# Altium project SumoBot.PrjPcb
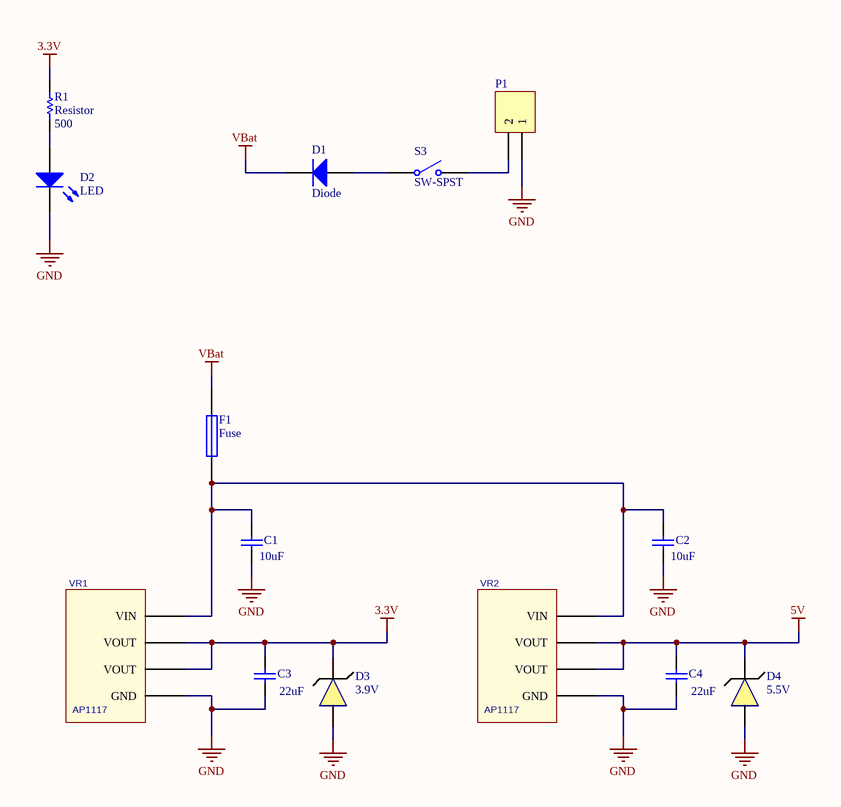
[diagram p0: Power_Regulation.SchDoc]
7 sheets, 86 parts. Net scope: global (net labels, ports and power ports of the same name join across sheets).
Board file: sumobot.PcbDoc
Sheets:
  Power_Regulation.SchDoc
  microcontroller.SchDoc
  Proximity_Sensors.SchDoc
  Motor_Control.SchDoc
  Servo.SchDoc
  Accelerometer.SchDoc
  Reflective_Sensors.SchDoc

## Sheet Power_Regulation.SchDoc
size A

### Parts
C1  value 10uF  [0805]  (hidden comment: Cap)
C2  value 10uF  [0805]  (hidden comment: Cap)
C3  value 22uF  [0805]  (hidden comment: Cap)
C4  value 22uF  [0805]  (hidden comment: Cap)
D1  Diode  [SMA]
D2  LED  [0603]
D3  3.9V  [DO-214AC]
D4  5.5V  [DO-214AC]
F1  Fuse  [0805]
P1  Header 2  [HDR1X2]  (value not drawn)
R1  Resistor  value 500  [0805]
S3  SW-SPST  [SPST Switch]
VR1  AP1117  [SOT-223]
VR2  AP1117  [SOT-223]

### Nets
3.3V: C3.2 D3.1 R1.2 VR1.2(VOUT) VR1.4(VOUT)
5V: C4.2 D4.1 VR2.2(VOUT) VR2.4(VOUT)
GND: C1.1 C2.1 C3.1 C4.1 D2.2(K) D3.2 D4.2 P1.1 VR1.1(GND) VR2.1(GND)
VBat: D1.2(K) F1.2
NetC1_2: C1.2 C2.2 F1.1 VR1.3(VIN) VR2.3(VIN)
NetD1_1: D1.1(A) S3.1(COMMON)
NetD2_1: D2.1(A) R1.1
NetP1_2: P1.2 S3.2(NO)

### Library data of the parts
C1-C4 = Cap: Capacitor
D1 = Diode: Default Diode
D2 = LED: Vendor Part Number: 751-1203-ND; Manufacturer: Vishay; Manufacturer Part Number: TSAL6100; Vendor: Digikey; Published: 16-Mar-2013; LatestRevisionDate: 16-Mar-2013; LatestRevisionNote: Created; PackageReference: LED; Publisher: Anthony Merlino; PackageDescription: 5mm LED; 2 Leads
D3 D4 = Zener Diode
P1 = Header 2: Header, 2-Pin; LatestRevisionDate: 17-Jul-2002; LatestRevisionNote: Re-released for DXP Platform.; Publisher: Altium Limited
S3 = SW-SPST: Single-Pole, Single-Throw Switch; Published: 24-Mar-1999; LatestRevisionDate: 17-Jul-2002; LatestRevisionNote: Re-released for DXP Platform.; PackageReference: SPST-2; Publisher: Altium Limited; PackageDescription: Switch; 2 Leads
F1 = Fuse: Published: 8-Jun-2000; LatestRevisionDate: 17-Jul-2002; LatestRevisionNote: Re-released for DXP Platform.; PackageReference: PIN-W2/E2.8; Publisher: Altium Limited; PackageDescription: Thru-Hole; 2 Leads
R1 = Resistor: Published: 8-Jun-2000; LatestRevisionDate: 17-Jul-2002; LatestRevisionNote: Re-released for DXP Platform.; PackageReference: AXIAL-0.3; Publisher: Altium Limited
VR1 VR2 = AP1117: Value: *

## Sheet microcontroller.SchDoc
size A
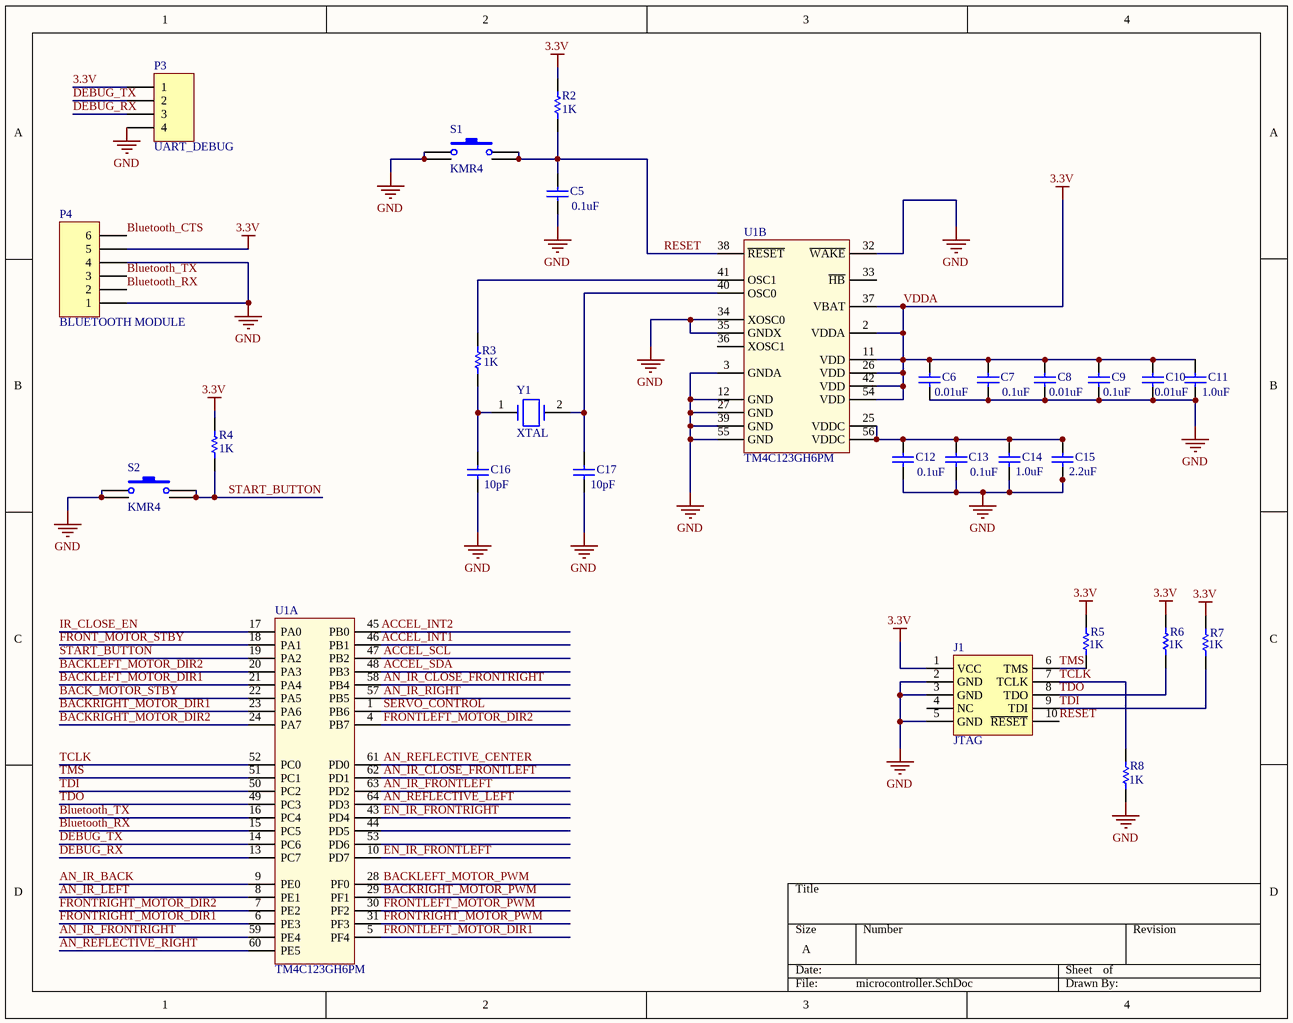
[diagram p1: microcontroller.SchDoc]

### Parts
C5  value 0.1uF  [0805]  (hidden comment: Cap)
C6  value 0.01uF  [0805]  (hidden comment: Cap)
C7  value 0.1uF  [0805]  (hidden comment: Cap)
C8  value 0.01uF  [0805]  (hidden comment: Cap)
C9  value 0.1uF  [0805]  (hidden comment: Cap)
C10  value 0.01uF  [0805]  (hidden comment: Cap)
C11  value 1.0uF  [0805]  (hidden comment: Cap)
C12  value 0.1uF  [0805]  (hidden comment: Cap)
C13  value 0.1uF  [0805]  (hidden comment: Cap)
C14  value 1.0uF  [0805]  (hidden comment: Cap)
C15  value 2.2uF  [0805]  (hidden comment: Cap)
C16  value 10pF  [0805]  (hidden comment: Cap)
C17  value 10pF  [0805]  (hidden comment: Cap)
J1  JTAG  [TAG Connect 10p]
P3  UART_DEBUG  [HDR1X4]
P4  BLUETOOTH MODULE  [HDR1X6]
R2  value 1K  [0805]  (hidden comment: Resistor)
R3  value 1K  [0805]  (hidden comment: Resistor)
R4  value 1K  [0805]  (hidden comment: Resistor)
R5  value 1K  [0805]  (hidden comment: Resistor)
R6  value 1K  [0805]  (hidden comment: Resistor)
R7  value 1K  [0805]  (hidden comment: Resistor)
R8  value 1K  [0805]  (hidden comment: Resistor)
S1  KMR4  [KMR4]
S2  KMR4  [KMR4]
U1  TM4C123GH6PM  [TSQFP50P1200X1200X145-64N]  (parts A,B of 2)
Y1  XTAL  [ABM3_SERIES]

### Nets
3.3V: C6.2 C7.2 C8.2 C9.2 C10.2 C11.2 J1.1(VCC) P3.1 P4.5 R2.2 R4.2 R5.2 R6.2 R7.2 U1.2(VDDA) U1.11(VDD) U1.26(VDD) U1.37(VBAT) U1.42(VDD) U1.54(VDD)  [also labelled VDDA]
GND: C5.1 C6.1 C7.1 C8.1 C9.1 C10.1 C11.1 C12.1 C13.1 C14.1 C15.1 C16.1 C17.1 J1.2(GND) J1.3(GND) J1.5(GND) P3.4 P4.1 P4.4 R8.1 S1.1 S1.3 S2.1 S2.3 U1.3(GNDA) U1.12(GND) U1.27(GND) U1.32(~{WAKE}) U1.34(XOSC0) U1.35(GNDX) U1.39(GND) U1.55(GND)
ACCEL_INT1: U1.46(PB1)
ACCEL_INT2: U1.45(PB0)
ACCEL_SCL: U1.47(PB2)
ACCEL_SDA: U1.48(PB3)
AN_IR_BACK: U1.9(PE0)
AN_IR_CLOSE_FRONTLEFT: U1.62(PD1)
AN_IR_CLOSE_FRONTRIGHT: U1.58(PB4)
AN_IR_FRONTLEFT: U1.63(PD2)
AN_IR_FRONTRIGHT: U1.59(PE4)
AN_IR_LEFT: U1.8(PE1)
AN_IR_RIGHT: U1.57(PB5)
AN_REFLECTIVE_CENTER: U1.61(PD0)
AN_REFLECTIVE_LEFT: U1.64(PD3)
AN_REFLECTIVE_RIGHT: U1.60(PE5)
BACK_MOTOR_STBY: U1.22(PA5)
BACKLEFT_MOTOR_DIR1: U1.21(PA4)
BACKLEFT_MOTOR_DIR2: U1.20(PA3)
BACKLEFT_MOTOR_PWM: U1.28(PF0)
BACKRIGHT_MOTOR_DIR1: U1.23(PA6)
BACKRIGHT_MOTOR_DIR2: U1.24(PA7)
BACKRIGHT_MOTOR_PWM: U1.29(PF1)
Bluetooth_CTS: P4.6
Bluetooth_RX: P4.2 U1.15(PC5)
Bluetooth_TX: P4.3 U1.16(PC4)
DEBUG_RX: P3.3 U1.13(PC7)
DEBUG_TX: P3.2 U1.14(PC6)
EN_IR_FRONTLEFT: U1.10(PD7)
EN_IR_FRONTRIGHT: U1.43(PD4)
FRONT_MOTOR_STBY: U1.18(PA1)
FRONTLEFT_MOTOR_DIR1: U1.5(PF4)
FRONTLEFT_MOTOR_DIR2: U1.4(PB7)
FRONTLEFT_MOTOR_PWM: U1.30(PF2)
FRONTRIGHT_MOTOR_DIR1: U1.6(PE3)
FRONTRIGHT_MOTOR_DIR2: U1.7(PE2)
FRONTRIGHT_MOTOR_PWM: U1.31(PF3)
IR_CLOSE_EN: U1.17(PA0)
RESET: C5.2 J1.10(~{RESET}) R2.1 S1.2 S1.4 U1.38(~{RESET})
SERVO_CONTROL: U1.1(PB6)
START_BUTTON: R4.1 S2.2 S2.4 U1.19(PA2)
TCLK: J1.7(TCLK) R8.2 U1.52(PC0)
TDI: J1.9(TDI) R7.1 U1.50(PC2)
TDO: J1.8(TDO) R6.1 U1.49(PC3)
TMS: J1.6(TMS) R5.1 U1.51(PC1)
NetC12_2: C12.2 C13.2 C14.2 C15.2 U1.25(VDDC) U1.56(VDDC)
NetC16_2: C16.2 R3.1 Y1.1(OSC1)
NetC17_2: C17.2 U1.40(OSC0) Y1.2(OSC2)
NetR3_2: R3.2 U1.41(OSC1)

Not connected (* = marked no-connect by the designer): J1 4(NC); U1 33(~{HB}) 36(XOSC1) 44(PD5) 53(PD6)

### Library data of the parts
C5-C17 = Cap: Capacitor
J1 = 10-Pin JTAG ARM: 10-Pin JTAG Connector for Cortex M4 etc.
P3 = Header 4: Header, 4-Pin; LatestRevisionDate: 17-Jul-2002; LatestRevisionNote: Re-released for DXP Platform.; Publisher: Altium Limited
P4 = Header 6: Header, 6-Pin; LatestRevisionDate: 17-Jul-2002; LatestRevisionNote: Re-released for DXP Platform.; Publisher: Altium Limited
S1 S2 = SPST Tactile Switch: Switch; Published: 24-Mar-1999; LatestRevisionDate: 17-Jul-2002; LatestRevisionNote: Re-released for DXP Platform.; PackageReference: SPST-2; Publisher: Altium Limited
U1 = TM4C123GH6PM: Tiva C TM4C123GH6PM
Y1 = XTAL: Crystal Oscillator; Published: 8-Jun-2000; LatestRevisionDate: 17-Jul-2002; LatestRevisionNote: Re-released for DXP Platform.; PackageReference: R38; Publisher: Altium Limited; PackageDescription: Crystal, Thru-Hole; 2 Leads; Body 3.1 x 8.2 mm (Dia.xH)
R2-R8 = Resistor: Published: 8-Jun-2000; LatestRevisionDate: 17-Jul-2002; LatestRevisionNote: Re-released for DXP Platform.; PackageReference: AXIAL-0.3; Publisher: Altium Limited

## Sheet Proximity_Sensors.SchDoc
size A
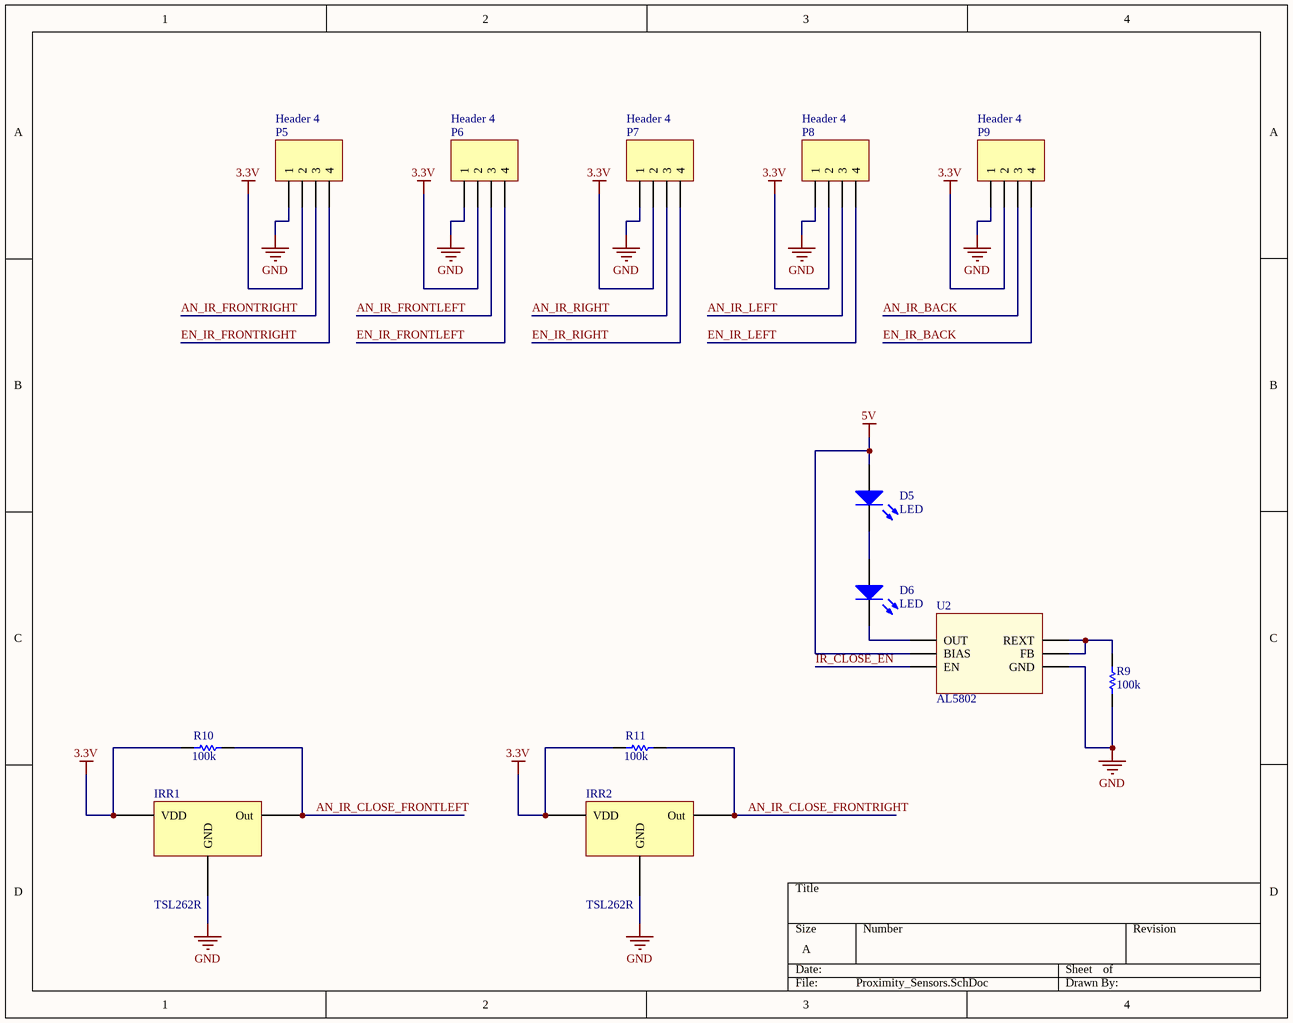
[diagram p2: Proximity_Sensors.SchDoc]

### Parts
D5  LED  [LED-Bent]
D6  LED  [LED-Bent]
IRR1  TSL262R  [TSL262R]
IRR2  TSL262R  [TSL262R]
P5  Header 4  [HDR1X4]
P6  Header 4  [HDR1X4]
P7  Header 4  [HDR1X4]
P8  Header 4  [HDR1X4]
P9  Header 4  [HDR1X4]
R9  value 100k  [0805]  (hidden comment: Resistor)
R10  value 100k  [0805]  (hidden comment: Resistor)
R11  value 100k  [0805]  (hidden comment: Resistor)
U2  AL5802  [SOT26]

### Nets
3.3V: IRR1.1(VDD) IRR2.1(VDD) P5.2 P6.2 P7.2 P8.2 P9.2 R10.1 R11.1
5V: D5.1(A) U2.2(BIAS)
GND: IRR1.0(GND) IRR2.0(GND) P5.1 P6.1 P7.1 P8.1 P9.1 R9.1 U2.4(GND)
AN_IR_BACK: P9.3
AN_IR_CLOSE_FRONTLEFT: IRR1.2(Out) R10.2
AN_IR_CLOSE_FRONTRIGHT: IRR2.2(Out) R11.2
AN_IR_FRONTLEFT: P6.3
AN_IR_FRONTRIGHT: P5.3
AN_IR_LEFT: P8.3
AN_IR_RIGHT: P7.3
EN_IR_BACK: P9.4
EN_IR_FRONTLEFT: P6.4
EN_IR_FRONTRIGHT: P5.4
EN_IR_LEFT: P8.4
EN_IR_RIGHT: P7.4
IR_CLOSE_EN: U2.3(EN)
NetD5_2: D5.2(K) D6.1(A)
NetD6_2: D6.2(K) U2.1(OUT)
NetR9_2: R9.2 U2.5(FB) U2.6(REXT)

### Library data of the parts
D5 D6 = LED: as D2 on sheet Power_Regulation; Published: 16-Mar-2013; LatestRevisionDate: 16-Mar-2013; LatestRevisionNote: Created; PackageReference: LED; Publisher: Anthony Merlino; PackageDescription: 5mm LED; 2 Leads
P5-P9 = Header 4: Header, 4-Pin; LatestRevisionDate: 17-Jul-2002; LatestRevisionNote: Re-released for DXP Platform.; Publisher: Altium Limited
R9-R11 = Resistor: Published: 8-Jun-2000; LatestRevisionDate: 17-Jul-2002; LatestRevisionNote: Re-released for DXP Platform.; PackageReference: AXIAL-0.3; Publisher: Altium Limited

## Sheet Motor_Control.SchDoc
size A
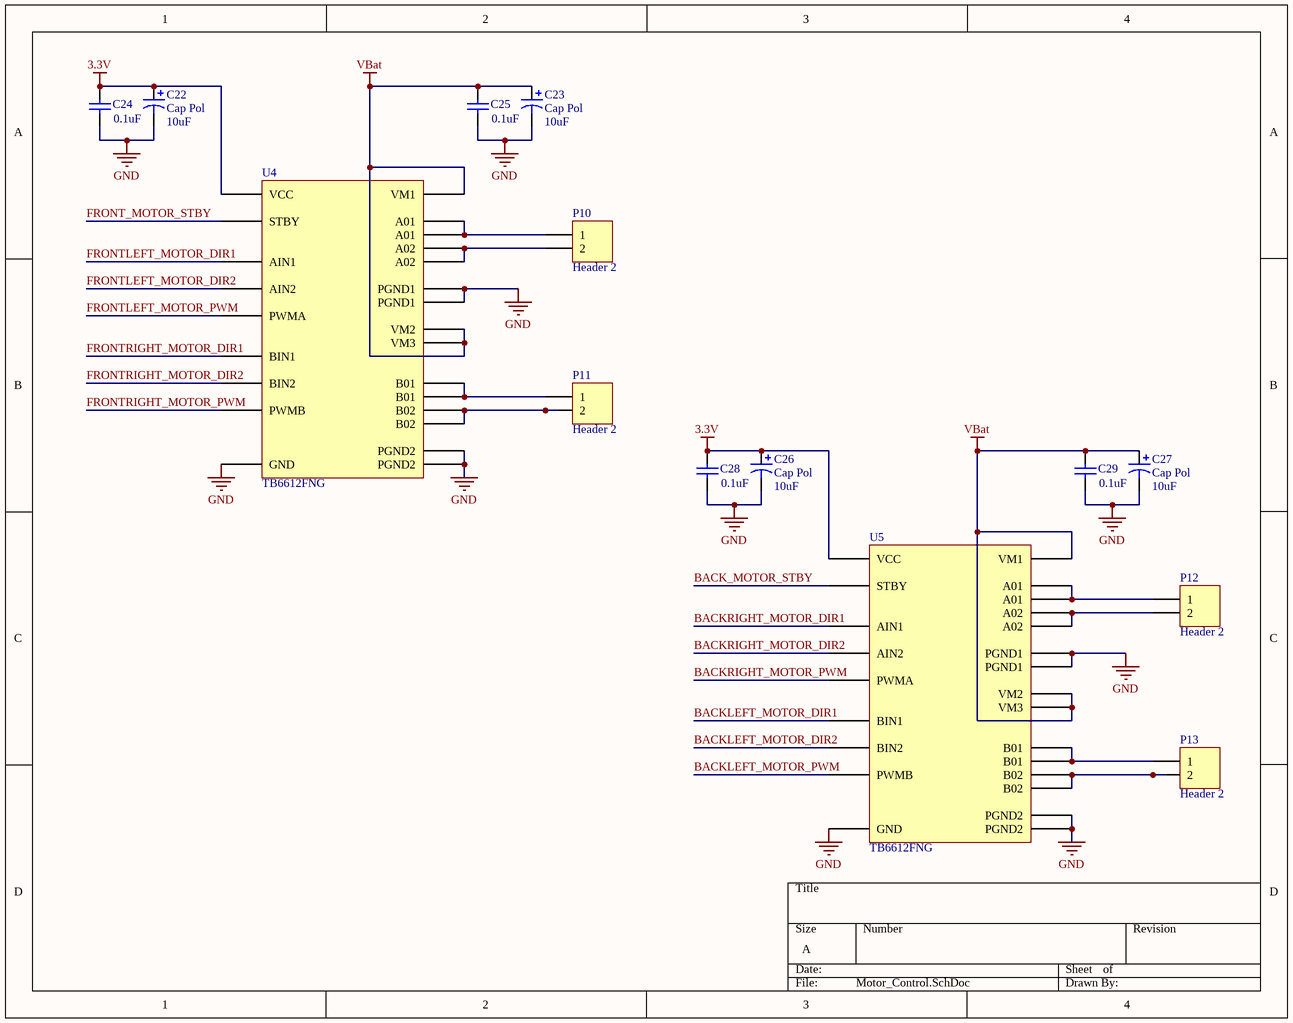
[diagram p3: Motor_Control.SchDoc]

### Parts
C22  Cap Pol  value 10uF  [1206]
C23  Cap Pol  value 10uF  [1206]
C24  value 0.1uF  [0805]  (hidden comment: Cap)
C25  value 0.1uF  [0805]  (hidden comment: Cap)
C26  Cap Pol  value 10uF  [1206]
C27  Cap Pol  value 10uF  [1206]
C28  value 0.1uF  [0805]  (hidden comment: Cap)
C29  value 0.1uF  [0805]  (hidden comment: Cap)
P10  Header 2  [HDR1X2]
P11  Header 2  [HDR1X2]
P12  Header 2  [HDR1X2]
P13  Header 2  [HDR1X2]
U4  TB6612FNG  [SSOP24-P-300-0.65A]
U5  TB6612FNG  [SSOP24-P-300-0.65A]

### Nets
3.3V: C22.1 C24.2 C26.1 C28.2 U4.20(VCC) U5.20(VCC)
GND: C22.2 C23.2 C24.1 C25.1 C26.2 C27.2 C28.1 C29.1 U4.3(PGND1) U4.4(PGND1) U4.9(PGND2) U4.10(PGND2) U4.18(GND) U5.3(PGND1) U5.4(PGND1) U5.9(PGND2) U5.10(PGND2) U5.18(GND)
VBat: C23.1 C25.2 C27.1 C29.2 U4.13(VM2) U4.14(VM3) U4.24(VM1) U5.13(VM2) U5.14(VM3) U5.24(VM1)
BACK_MOTOR_STBY: U5.19(STBY)
BACKLEFT_MOTOR_DIR1: U5.17(BIN1)
BACKLEFT_MOTOR_DIR2: U5.16(BIN2)
BACKLEFT_MOTOR_PWM: U5.15(PWMB)
BACKRIGHT_MOTOR_DIR1: U5.21(AIN1)
BACKRIGHT_MOTOR_DIR2: U5.22(AIN2)
BACKRIGHT_MOTOR_PWM: U5.23(PWMA)
FRONT_MOTOR_STBY: U4.19(STBY)
FRONTLEFT_MOTOR_DIR1: U4.21(AIN1)
FRONTLEFT_MOTOR_DIR2: U4.22(AIN2)
FRONTLEFT_MOTOR_PWM: U4.23(PWMA)
FRONTRIGHT_MOTOR_DIR1: U4.17(BIN1)
FRONTRIGHT_MOTOR_DIR2: U4.16(BIN2)
FRONTRIGHT_MOTOR_PWM: U4.15(PWMB)
NetP10_1: P10.1 U4.1(A01) U4.2(A01)
NetP10_2: P10.2 U4.5(A02) U4.6(A02)
NetP11_1: P11.1 U4.11(B01) U4.12(B01)
NetP11_2: P11.2 U4.7(B02) U4.8(B02)
NetP12_1: P12.1 U5.1(A01) U5.2(A01)
NetP12_2: P12.2 U5.5(A02) U5.6(A02)
NetP13_1: P13.1 U5.11(B01) U5.12(B01)
NetP13_2: P13.2 U5.7(B02) U5.8(B02)

### Library data of the parts
C22 C23 C26 C27 = Cap Pol: Polarized Capacitor
C24 C25 C28 C29 = Cap: Capacitor
P10-P13 = Header 2: Header, 2-Pin; LatestRevisionDate: 17-Jul-2002; LatestRevisionNote: Re-released for DXP Platform.; Publisher: Altium Limited
U4 U5 = TB6612FNG: Vendor Part No.: TB6612FNG(OC8EL)CT-ND; Manufacturer: Toshiba; Vendor: Digikey; Manufacturer Part No: TB6612FNG

## Sheet Servo.SchDoc
size A
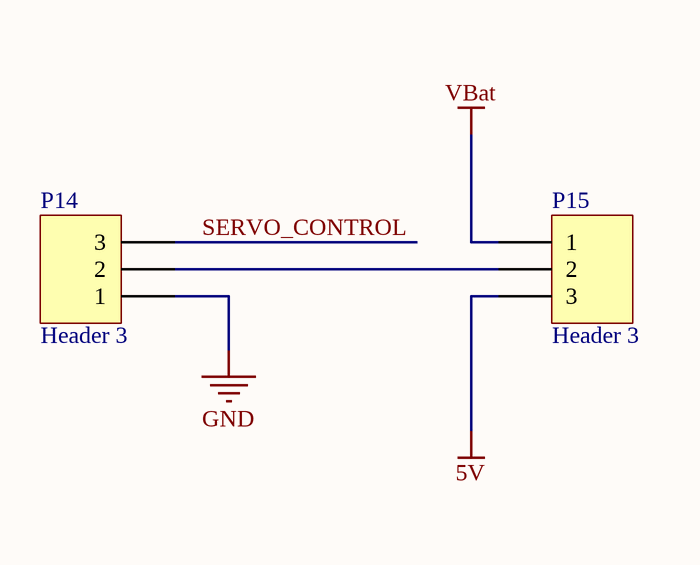
[diagram p4: Servo.SchDoc]

### Parts
P14  Header 3  [HDR1X3]
P15  Header 3  [HDR1X3]

### Nets
5V: P15.3
GND: P14.1
VBat: P15.1
SERVO_CONTROL: P14.3
NetP14_2: P14.2 P15.2

### Library data of the parts
P14 P15 = Header 3: Header, 3-Pin; LatestRevisionDate: 17-Jul-2002; LatestRevisionNote: Re-released for DXP Platform.; Publisher: Altium Limited

## Sheet Accelerometer.SchDoc
size A
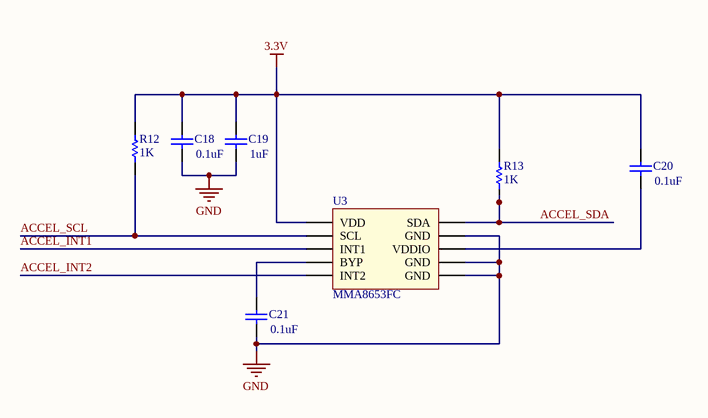
[diagram p5: Accelerometer.SchDoc]

### Parts
C18  value 0.1uF  [0805]  (hidden comment: Cap)
C19  value 1uF  [0805]  (hidden comment: Cap)
C20  value 0.1uF  [0805]  (hidden comment: Cap)
C21  value 0.1uF  [0805]  (hidden comment: Cap)
R12  value 1K  [0805]  (hidden comment: Resistor)
R13  value 1K  [0805]  (hidden comment: Resistor)
U3  MMA8653FC  [DFN-10]

### Nets
3.3V: C18.2 C19.2 C20.2 R12.2 R13.2 U3.1(VDD)
GND: C18.1 C19.1 C21.1 U3.6(GND) U3.7(GND) U3.9(GND)
ACCEL_INT1: U3.3(INT1)
ACCEL_INT2: U3.5(INT2)
ACCEL_SCL: R12.1 U3.2(SCL)
ACCEL_SDA: R13.1 U3.10(SDA)
NetC20_1: C20.1 U3.8(VDDIO)
NetC21_2: C21.2 U3.4(BYP)

### Library data of the parts
C18-C21 = Cap: Capacitor
U3 = MMA8653FC: MMA8653FC Accelerometer 3-Axis
R12 R13 = Resistor: Published: 8-Jun-2000; LatestRevisionDate: 17-Jul-2002; LatestRevisionNote: Re-released for DXP Platform.; PackageReference: AXIAL-0.3; Publisher: Altium Limited

## Sheet Reflective_Sensors.SchDoc
size A
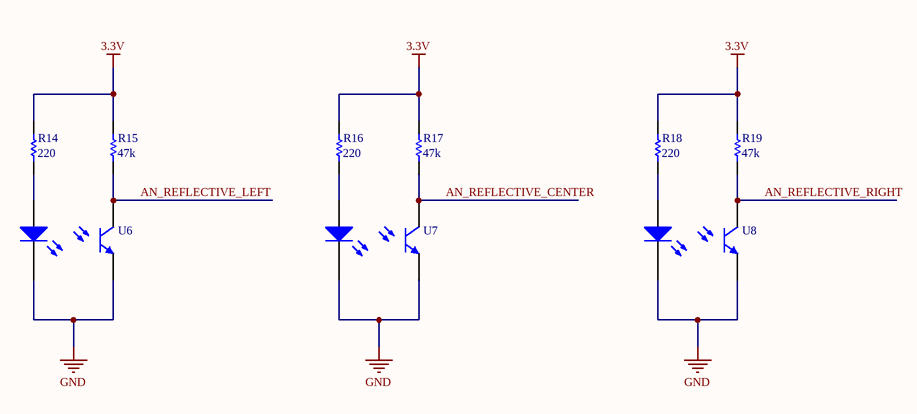
[diagram p6: Reflective_Sensors.SchDoc]

### Parts
R14  value 220  [0805]  (hidden comment: Resistor)
R15  value 47k  [0805]  (hidden comment: Resistor)
R16  value 220  [0805]  (hidden comment: Resistor)
R17  value 47k  [0805]  (hidden comment: Resistor)
R18  value 220  [0805]  (hidden comment: Resistor)
R19  value 47k  [0805]  (hidden comment: Resistor)
U6  QRE1113GR  [QRE1113GR]  (value not drawn)
U7  QRE1113GR  [QRE1113GR]  (value not drawn)
U8  QRE1113GR  [QRE1113GR]  (value not drawn)

### Nets
3.3V: R14.2 R15.2 R16.2 R17.2 R18.2 R19.2
GND: U6.2(CATHODE) U6.4(EMITTER) U7.2(CATHODE) U7.4(EMITTER) U8.2(CATHODE) U8.4(EMITTER)
AN_REFLECTIVE_CENTER: R17.1 U7.3(COLLECTOR)
AN_REFLECTIVE_LEFT: R15.1 U6.3(COLLECTOR)
AN_REFLECTIVE_RIGHT: R19.1 U8.3(COLLECTOR)
NetR14_1: R14.1 U6.1(ANODE)
NetR16_1: R16.1 U7.1(ANODE)
NetR18_1: R18.1 U8.1(ANODE)

### Library data of the parts
R14-R19 = Resistor: Published: 8-Jun-2000; LatestRevisionDate: 17-Jul-2002; LatestRevisionNote: Re-released for DXP Platform.; PackageReference: AXIAL-0.3; Publisher: Altium Limited

## Nets that join several sheets
3.3V: Power_Regulation (5 pins), microcontroller (20 pins), Proximity_Sensors (9 pins), Motor_Control (6 pins), Accelerometer (6 pins), Reflective_Sensors (6 pins)
5V: Power_Regulation (C4.2 D4.1 VR2.2 VR2.4), Proximity_Sensors (D5.1 U2.2), Servo (P15.3)
GND: Power_Regulation (10 pins), microcontroller (32 pins), Proximity_Sensors (9 pins), Motor_Control (18 pins), Servo (P14.1), Accelerometer (6 pins), Reflective_Sensors (6 pins)
VBat: Power_Regulation (D1.2 F1.2), Motor_Control (10 pins), Servo (P15.1)
ACCEL_INT1: microcontroller (U1.46), Accelerometer (U3.3)
ACCEL_INT2: microcontroller (U1.45), Accelerometer (U3.5)
ACCEL_SCL: microcontroller (U1.47), Accelerometer (R12.1 U3.2)
ACCEL_SDA: microcontroller (U1.48), Accelerometer (R13.1 U3.10)
AN_IR_BACK: microcontroller (U1.9), Proximity_Sensors (P9.3)
AN_IR_CLOSE_FRONTLEFT: microcontroller (U1.62), Proximity_Sensors (IRR1.2 R10.2)
AN_IR_CLOSE_FRONTRIGHT: microcontroller (U1.58), Proximity_Sensors (IRR2.2 R11.2)
AN_IR_FRONTLEFT: microcontroller (U1.63), Proximity_Sensors (P6.3)
AN_IR_FRONTRIGHT: microcontroller (U1.59), Proximity_Sensors (P5.3)
AN_IR_LEFT: microcontroller (U1.8), Proximity_Sensors (P8.3)
AN_IR_RIGHT: microcontroller (U1.57), Proximity_Sensors (P7.3)
AN_REFLECTIVE_CENTER: microcontroller (U1.61), Reflective_Sensors (R17.1 U7.3)
AN_REFLECTIVE_LEFT: microcontroller (U1.64), Reflective_Sensors (R15.1 U6.3)
AN_REFLECTIVE_RIGHT: microcontroller (U1.60), Reflective_Sensors (R19.1 U8.3)
BACK_MOTOR_STBY: microcontroller (U1.22), Motor_Control (U5.19)
BACKLEFT_MOTOR_DIR1: microcontroller (U1.21), Motor_Control (U5.17)
BACKLEFT_MOTOR_DIR2: microcontroller (U1.20), Motor_Control (U5.16)
BACKLEFT_MOTOR_PWM: microcontroller (U1.28), Motor_Control (U5.15)
BACKRIGHT_MOTOR_DIR1: microcontroller (U1.23), Motor_Control (U5.21)
BACKRIGHT_MOTOR_DIR2: microcontroller (U1.24), Motor_Control (U5.22)
BACKRIGHT_MOTOR_PWM: microcontroller (U1.29), Motor_Control (U5.23)
EN_IR_FRONTLEFT: microcontroller (U1.10), Proximity_Sensors (P6.4)
EN_IR_FRONTRIGHT: microcontroller (U1.43), Proximity_Sensors (P5.4)
FRONT_MOTOR_STBY: microcontroller (U1.18), Motor_Control (U4.19)
FRONTLEFT_MOTOR_DIR1: microcontroller (U1.5), Motor_Control (U4.21)
FRONTLEFT_MOTOR_DIR2: microcontroller (U1.4), Motor_Control (U4.22)
FRONTLEFT_MOTOR_PWM: microcontroller (U1.30), Motor_Control (U4.23)
FRONTRIGHT_MOTOR_DIR1: microcontroller (U1.6), Motor_Control (U4.17)
FRONTRIGHT_MOTOR_DIR2: microcontroller (U1.7), Motor_Control (U4.16)
FRONTRIGHT_MOTOR_PWM: microcontroller (U1.31), Motor_Control (U4.15)
IR_CLOSE_EN: microcontroller (U1.17), Proximity_Sensors (U2.3)
SERVO_CONTROL: microcontroller (U1.1), Servo (P14.3)